# EAGLE design i2c (EAGLE 9.5.2)
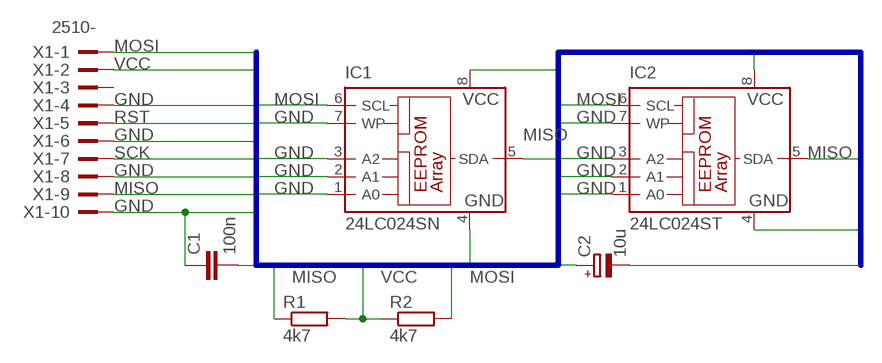
[diagram p0: schematic, sheet 1]

## Parts
C1  100n  C-EUC0805K  [C0805K]
C2  10u  CPOL-EUSMCD  [SMC_D]
IC1  24LC024SN  [SO-08]
IC2  24LC024ST  [TSSOP8]
R1  4k7  R0204/7  [0204/7]
R2  4k7  R0204/7  [0204/7]
X1  2510-  [PAK100/2500-10]

## Nets
GND: C1.1 C2.- IC1.1(A0) IC1.2(A1) IC1.3(A2) IC1.4(GND) IC1.7(WP) IC2.1(A0) IC2.2(A1) IC2.3(A2) IC2.4(GND) IC2.7(WP) X1.4 X1.6 X1.8 X1.10
MISO: IC1.5(SDA) IC2.5(SDA) R1.1 X1.9
MOSI: IC1.6(SCL) IC2.6(SCL) R2.2 X1.1
RST: X1.5
SCK: X1.7
VCC: C1.2 C2.+ IC1.8(VCC) IC2.8(VCC) R1.2 R2.1 X1.2
Unconnected: X1.3

## Buses
GND,MISO,MOSI,RST,SCK,VCC

## Library data of the parts
C1 = resistor:C-EU: CAPACITOR, European symbol
C2 = resistor:CPOL-EU: POLARIZED CAPACITOR, European symbol
IC1 = microchip:24*: Serial EEPROM I2C; MF: MICROCHIP; MPN: 24LC024/SN; OC_FARNELL: 1659744; OC_NEWARK: 92C7092
IC2 = microchip:24*: Serial EEPROM I2C; MPN: 24LC024H-I/ST; OC_FARNELL: 1659745; OC_NEWARK: 77M3584
R1 R2 = eagle-ltspice:R: RESISTOR, European symbol; SPICEMODEL: NONE; SPICEPREFIX: R
X1 = con-3m:2510-: 3M (TM) Pak 100 4-Wall Header Source: 3M; MF: 3M; MPN: 2510-6002UB; OC_FARNELL: 9838244; OC_NEWARK: 46F4725

## Board
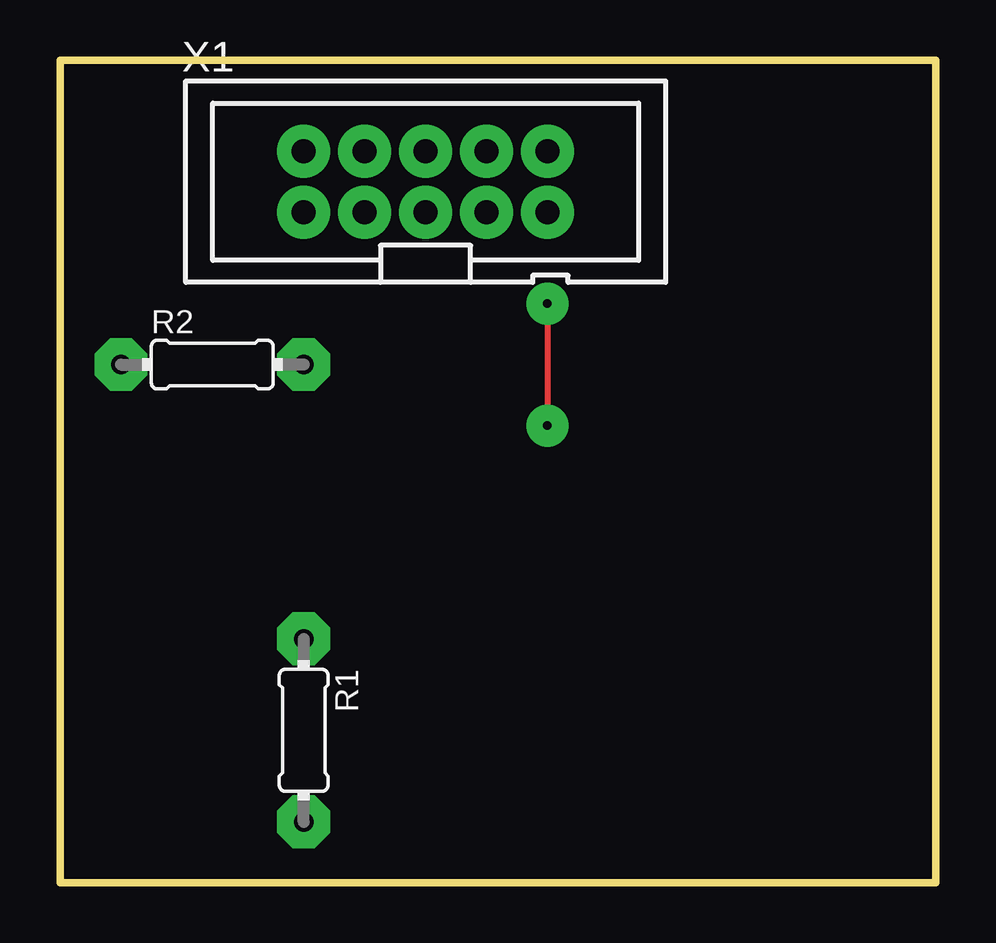
[diagram p1: board, top side]
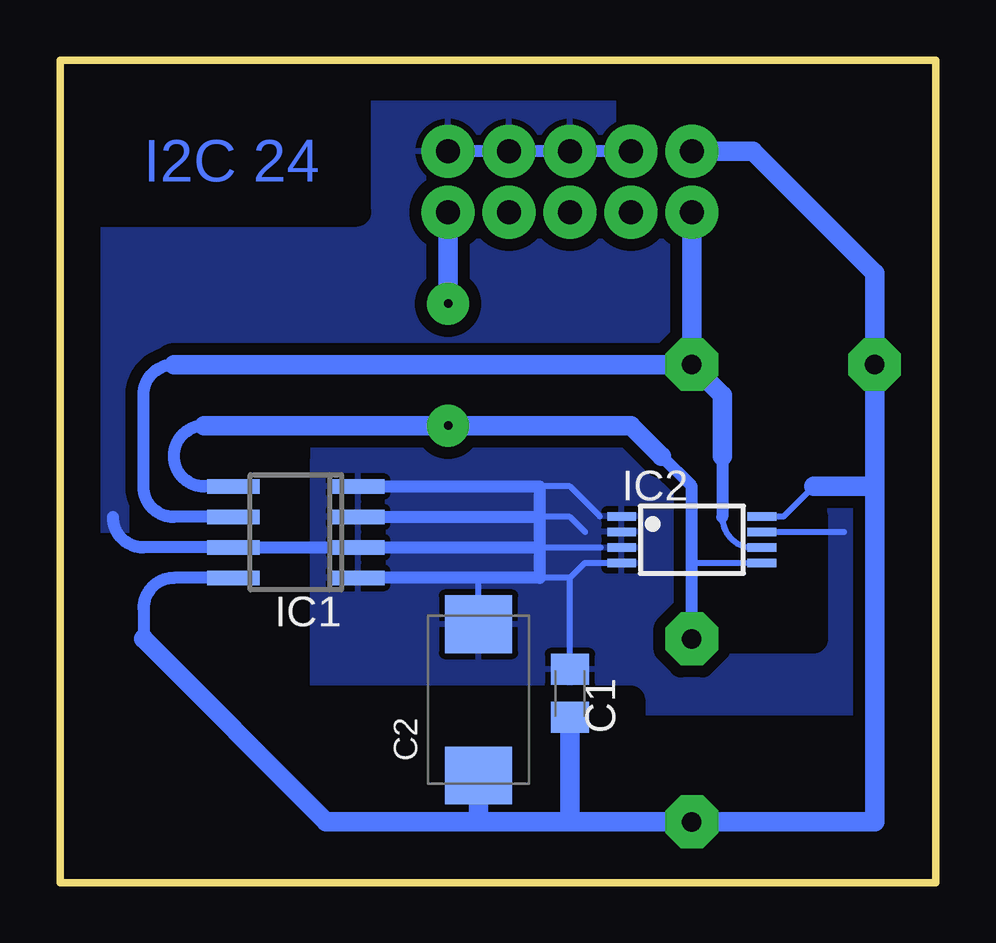
[diagram p2: board, bottom side, seen from below]

Size 36.5 x 34.28 mm. Coordinates in mm from the lower left corner, seen from the top.
Outline: 0,0 36.5,0 36.5,34.28 0,34.28 0,0
Copper layers (1*16): Top 0.035mm / dielectric 1.5mm / Bottom 0.035mm
Design rules "i2c": minimum track width 0.2mm, minimum drill 0.35mm, track to track 16mil, track to pad 10mil, pad to pad 0.205mm, via to via 0.205mm, smd to smd 8mil, copper to edge 60mil, drill to drill 60mil, minimum pad ring 0.6mm, minimum via ring 0.7mm, stop-mask expansion 4mil, vias tented up to drill 0mil, thermal gap 10mil
bRestrict: area 12.7,0 to 36.8,7.6; area 0,0 to 12.7,6.3; area 26.7,17.8 to 31.8,19.1; area 26.7,7.6 to 33,17.8; area 0,30.5 to 12.7,34.3; area 33,8.9 to 36.8,14; area 24.1,27.9 to 35.6,33; area 5.1,10.2 to 8.9,15.2

### Footprints (pad centres in the part's own frame; a part is rotated, then mirrored left to right if it is on the bottom)
C0805K = smd 1.3 x 1.6: 1 -1,0; 2 1,0
SMC_D = smd 2.4 x 2.8: + -3.15,0; - 3.15,0
SO-08 = smd 0.6 x 2.2: 1 -1.905,-2.6; 2 -0.635,-2.6; 3 0.635,-2.6; 4 1.905,-2.6; 5 1.905,2.6; 6 0.635,2.6; 7 -0.635,2.6; 8 -1.905,2.6
TSSOP8 = smd 0.35 x 1.2: 1 -0.975,-2.925; 2 -0.325,-2.925; 3 0.325,-2.925; 4 0.975,-2.925; 5 0.975,2.925; 6 0.325,2.925; 7 -0.325,2.925; 8 -0.975,2.925
0204/7 = drill 0.813 pad 2.2 octagon: 1 -3.81,0; 2 3.81,0
PAK100/2500-10 = drill 1 pad 2.2: 1 -5.08,-1.27; 2 -5.08,1.27; 3 -2.54,-1.27; 4 -2.54,1.27; 5 0,-1.27; 6 0,1.27; 7 2.54,-1.27; 8 2.54,1.27; 9 5.08,-1.27; 10 5.08,1.27

### Placement (x,y rotation side)
C1  15.24,7.89 270 bottom
C2  19.05,7.62 90 bottom
IC1  26.67,14.61 90 bottom
IC2  10.16,14.29 270 bottom
R1  10.16,6.35 270 top
R2  6.35,21.59 0 top
X1  15.24,29.21 0 top

### Tracks (layer width: path | path; a pad name or v marks a point on that pad's centre or on a via)
GND
  Bottom 0.254: 16.49,16.53 16.51,16.51 15.24,16.51 13.99,15.26 | 14.61,14.61 15.24,15.24 16.51,15.24 | 13.97,13.97 13.96,13.96 16.5,13.96 16.51,13.97 | IC2.4 14.63,13.31 15.24,12.7 | 15.24,12.7 16.51,12.7 | IC2.7 3.81,14.61 | C1.1 15.24,12.7 | C2.- 19.05,12.7 | IC1.7 30.48,13.97
  Bottom 0.508: IC1.4 16.51,16.51 16.51,15.24 | 16.51,15.24 16.51,13.97 | 16.51,13.97 16.51,12.7 19.05,12.7 IC1.1 | IC1.3 16.51,15.24 | 16.51,13.97 IC1.2 IC1.7 33.02,13.97 arc90 34.29,15.24 | X1.10 X1.8 X1.6 X1.4
  pour Bottom (isolate 0.5): 0,34.29 36.83,34.29 36.83,0 0,0
MISO  (via drill 0.35)
  Top 0.254: v20.32,24.13 v20.32,19.05
  Bottom 0.254: 10.16,13.31 IC2.5 7.01,13.31
  Bottom 0.508: 11.43,17.78 10.16,16.51 10.16,13.31 R1.1 | IC1.5 30.48,16.51 arc90 31.75,17.78 arc90 30.48,19.05
  Bottom 0.813: X1.9 v20.32,24.13 | 11.43,17.78 12.7,19.05 v20.32,19.05 30.48,19.05
MOSI
  Bottom 0.254: IC1.6 30.48,15.24 | 8.89,15.24 arc-90 7.61,13.96 IC2.6
  Bottom 0.508: 8.89,17.78 8.89,15.24 | IC1.6 31.75,15.24 arc90 33.02,16.51 33.02,20.32 arc90 31.75,21.59
  Bottom 0.813: X1.1 R2.2 | R2.2 8.89,20.32 8.89,17.78 | R2.2 31.75,21.59
VCC
  Bottom 0.254: IC2.8 6.33,15.26 5.08,16.51 | IC1.8 30.48,12.7 | 19.05,3.81 C2.+
  Bottom 0.508: IC1.8 31.75,12.7 arc-90 33.02,11.43 33.02,10.16
  Bottom 0.813: 33.02,10.16 25.4,2.54 19.05,2.54 | 19.05,2.54 19.05,3.81 | 19.05,2.54 15.24,2.54 | 15.24,2.54 R1.2 2.54,2.54 2.54,16.51 | 2.54,16.51 R2.1 2.54,25.4 7.62,30.48 X1.2 | C1.2 15.24,2.54 | 2.54,16.51 5.08,16.51

### Text on the board
Bottom: I2C 24